# Altium schematic sheet RECEIVER.SchDoc: NOT USED
size A; ApprovedBy: NOT USED; CheckedBy: NOT USED; Author: NOT USED; CompanyName: NOT USED; DrawnBy: NOT USED; Engineer: NOT USED; Organization: NOT USED; Address1: NOT USED; Address2: NOT USED; Address3: NOT USED; Address4: NOT USED; Revision: NOT USED; SheetNumber: 2; SheetTotal: 2; sch_PageDescription: sch_PageDescription; sch_PageTitle: sch_PageTitle; DocumentFullPathAndName: NOT USED; DocumentName: NOT USED; ImagePath: NOT USED; ProjectName: NOT USED; Application_BuildNumber: NOT USED
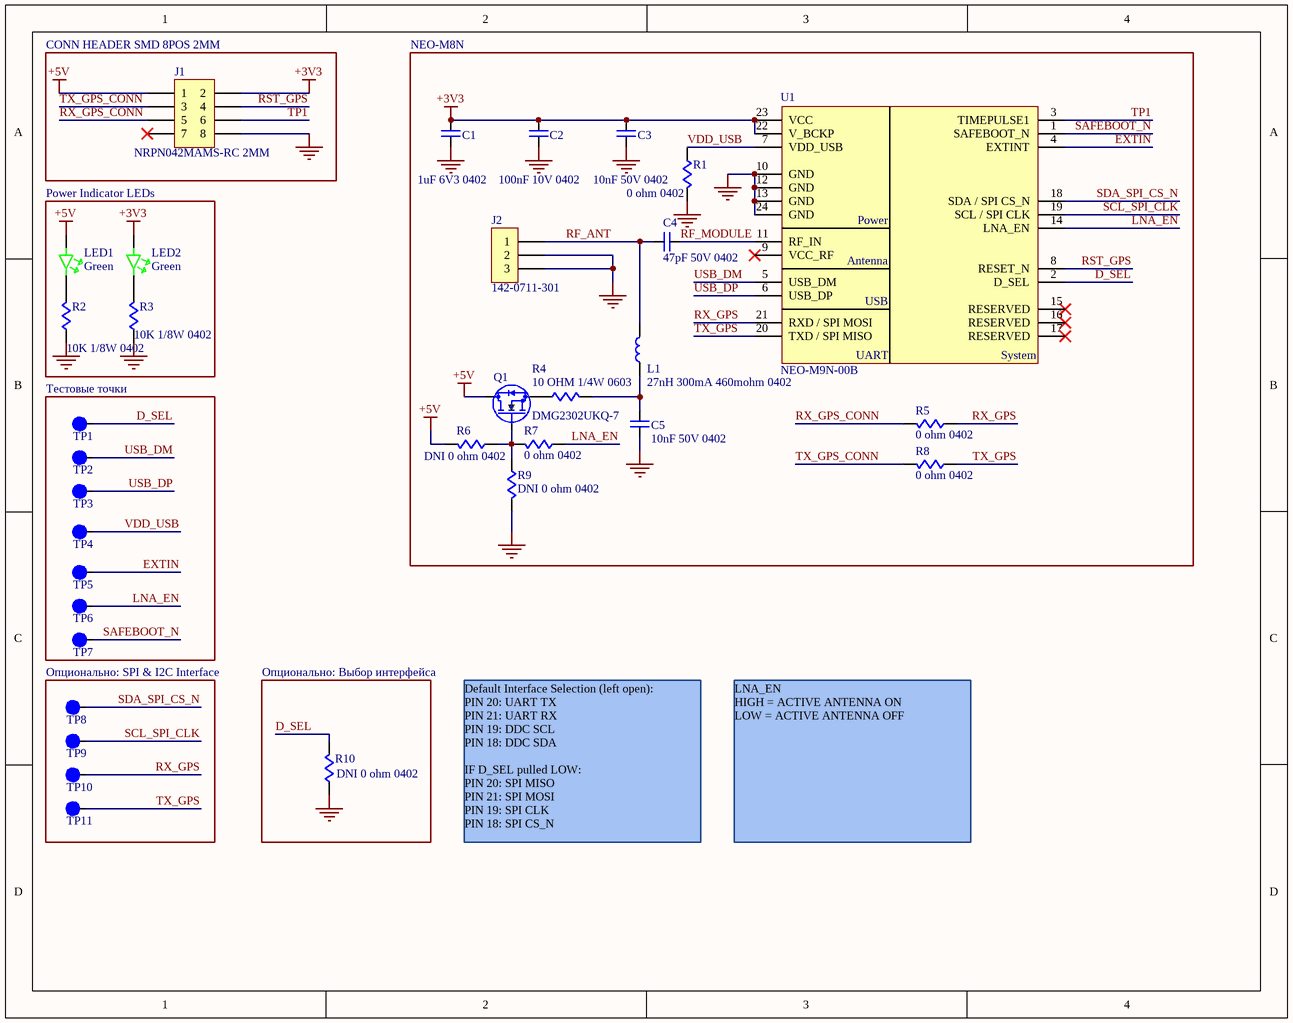
[diagram p0: RECEIVER.SchDoc]

## Parts
C1  1uF 6V3 0402  [c0402]
C2  100nF 10V 0402  [c0402]
C3  10nF 50V 0402  [c0402]
C4  47pF 50V 0402  [c0402]
C5  10nF 50V 0402  [c0402]
J1  NRPN042MAMS-RC 2MM  [CONN_NRPN042MAMS-RC]
J2  142-0711-301  [CONN_131-3711-301]
L1  27nH 300mA 460mohm 0402  [L0402]
LED1  Green  [led0603]
LED2  Green  [led0603]
Q1  DMG2302UKQ-7  [SOT23]
R1  0 ohm 0402  [r0402]
R2  10K 1/8W 0402  [r0402]
R3  10K 1/8W 0402  [r0402]
R4  10 OHM 1/4W 0603  [r0603]
R5  0 ohm 0402  [r0402]
R6  DNI 0 ohm 0402  [r0402]
R7  0 ohm 0402  [r0402]
R8  0 ohm 0402  [r0402]
R9  DNI 0 ohm 0402  [r0402]
R10  DNI 0 ohm 0402  [r0402]
TP1  1MM  [TP1MM]  (value not drawn)  (no BOM)
TP2  1MM  [TP1MM]  (value not drawn)  (no BOM)
TP3  1MM  [TP1MM]  (value not drawn)  (no BOM)
TP4  1MM  [TP1MM]  (value not drawn)  (no BOM)
TP5  1MM  [TP1MM]  (value not drawn)  (no BOM)
TP6  1MM  [TP1MM]  (value not drawn)  (no BOM)
TP7  1MM  [TP1MM]  (value not drawn)  (no BOM)
TP8  1MM  [TP1MM]  (value not drawn)  (no BOM)
TP9  1MM  [TP1MM]  (value not drawn)  (no BOM)
TP10  1MM  [TP1MM]  (value not drawn)  (no BOM)
TP11  1MM  [TP1MM]  (value not drawn)  (no BOM)
U1  NEO-M9N-00B  [IC_NEO-M9N]

## Blocks framed on the sheet
CONN HEADER SMD 8POS 2MM: J1
NEO-M8N: C1-C5 J2 L1 Q1 R1 R4-R9 U1
Power Indicator LEDs: LED1 LED2 R2 R3
Тестовые точки: TP1-TP7
Опционально: SPI & I2C Interface: TP8-TP11
Опционально: Выбор интерфейса: R10

## Nets
+3V3: C1.2 C2.2 C3.2 J1.2 LED2.1 U1.22(V_BCKP) U1.23(VCC)
+5V: J1.1 LED1.1 Q1.2(D) R6.2
GND: C1.1 C2.1 C3.1 C5.1 J1.8 J2.2 J2.3 R1.2 R2.1 R3.1 R9.2 R10.1 U1.10(GND) U1.12(GND) U1.13(GND) U1.24(GND)
D_SEL: R10.2 TP1.1 U1.2(D_SEL)
EXTIN: TP5.1 U1.4(EXTINT)
LNA_EN: R7.1 TP6.1 U1.14(LNA_EN)
RF_ANT: C4.1 J2.1 L1.2
RF_MODULE: C4.2 U1.11(RF_IN)
RST_GPS: J1.4 U1.8(RESET_N)
RX_GPS: R5.1 TP10.1 U1.21(RXD_/_SPI_MOSI)
RX_GPS_CONN: J1.5 R5.2
SAFEBOOT_N: TP7.1 U1.1(SAFEBOOT_N)
SCL_SPI_CLK: TP9.1 U1.19(SCL_/_SPI_CLK)
SDA_SPI_CS_N: TP8.1 U1.18(SDA_/_SPI_CS_N)
TP1: J1.6 U1.3(TIMEPULSE1)
TX_GPS: R8.1 TP11.1 U1.20(TXD_/_SPI_MISO)
TX_GPS_CONN: J1.3 R8.2
USB_DM: TP2.1 U1.5(USB_DM)
USB_DP: TP3.1 U1.6(USB_DP)
VDD_USB: R1.1 TP4.1 U1.7(VDD_USB)
NetC5_2: C5.2 L1.1 R4.2
NetLED1_2: LED1.2 R2.2
NetLED2_2: LED2.2 R3.2
NetQ1_1: Q1.1(G) R6.1 R7.2 R9.1
NetQ1_3: Q1.3(S) R4.1

Not connected (* = marked no-connect by the designer): J1 7*; U1 9(VCC_RF)* 15(RESERVED)* 16(RESERVED)* 17(RESERVED)*

## Notes on the sheet
- Default Interface Selection (left open):
  PIN 20: UART TX
  PIN 21: UART RX
  PIN 19: DDC SCL
  PIN 18: DDC SDA
  IF D_SEL pulled LOW:
  PIN 20: SPI MISO
  PIN 21: SPI MOSI
  PIN 19: SPI CLK
  PIN 18: SPI CS_N
- LNA_EN
  HIGH = ACTIVE ANTENNA ON
  LOW = ACTIVE ANTENNA OFF
- CONFIDENTIALITY NOTICE
- TITLE
- PROJECT
- ENGINEER
- FILENAME
- GENERATED DATE
- DESCRIPTION
- SCHEMATIC NUMBER
- REV
- SHEET
- THIS DOCUMENT IS CONFIDENTIAL AND CONTAINS DESIGNS AND OTHER PROPRIETARY INFORMATION OF META PLATFORMS TECHNOLOGIES, LLC AND ITS AFFILIATES. THIS DOCUMENT AND THE INFORMATION IT CONTAINS MAY NOT BE DUPLICATED, DISCLOSED OR USED, IN WHOLE OR IN PART, FOR ANY PURPOSE (INCLUDING MANUFACTURE OF ANY COMPONENT) WITHOUT THE PRIOR WRITTEN CONSENT OF META PLATFORMS TECHNOLOGIES, LLC.
- (in symbol IC NEO-M9N-00B) Power; Antenna; USB; UART; System

## Library data of the parts
C1 = CAP CER 1UF 6.3V X7R 0402: 0402 1 uF 6.3 V ±10% Tolerance X7R Multilayer Ceramic Capacitor; Manufacturer: Murata; Manufacturer Part Number: GRM155R70J105KA12J; Voltage Rating: 6.3V; Supplier 1: Digi-Key; RoHS: Yes; Category: Ceramic Capacitors; Stock 1: 7275801; Pricing 1: 1=0.10000, 10=0.07300, 50=0.04000, 100=0.03270, 500=0.02334, 1000=0.01833, 2500=0.01666, 5000=0.01533 (USD); Mount: Surface Mount; Case/Package: 0402; Case Code (Metric): 1005; Case Code (Imperial): 0402; Weight: 0.000212oz; Min Operating Temperature: -55°C; Max Operating Temperature: 125°C; Packaging: Tape and Reel; Capacitance: 1uF; Tolerance: 10%; Dielectric: X7R; Termination: SMD/SMT; Voltage Rating (DC): 6.3V; Package Quantity: 50000; Length: 0.039inch; Width: 0.02inch; Thickness: 0.022inch; RoHS Compliant: Yes; ComponentLink1URL: http://www.mouser.com/ds/2/281/c02e-2905.pdf?src-supplier=Mouser; ComponentLink1Description: http://www.mouser.com/ds/2/281/c02e-2905.pdf?src-supplier=Mouser; ComponentLink2URL: http://search.murata.co.jp/Ceramy/image/img/A01X/G101/ENG/GRM155R70J105KA12-01.pdf?src-supplier=Digi-Key; ComponentLink2Description: http://search.murata.co.jp/Ceramy/image/img/A01X/G101/ENG/GRM155R70J105KA12-01.pdf?src-supplier=Digi-Key; Supplier Part Number 1: 490-13339-1-ND
C2 = CAP CER 0.1UF 10V X7R 0402: CL05 Series 0.1 uF 10 V ±10 % Tolerance X7R SMT Multilayer Ceramic Capacitor; Manufacturer: Samsung; Manufacturer Part Number: CL05B104KP5NNNC; Tolerance: 10%; Supplier 1: Digi-Key; RoHS: Yes; Category: Ceramic Capacitors; Stock 1: 36338332; Pricing 1: 1=0.10000, 10=0.02400, 50=0.01300, 100=0.01050, 500=0.00752, 1000=0.00592, 2500=0.00538, 5000=0.00495 (USD); Mount: Surface Mount; Case/Package: 0402; Case Code (Metric): 1005; Case Code (Imperial): 0402; Contact Plating: Tin; Min Operating Temperature: -55°C; Max Operating Temperature: 125°C; Package Quantity: 1; Packaging: Tape and Reel; Capacitance: 100nF; Voltage Rating: 10V; Dielectric: X7R; Series: CL; Construction: Flat; Length: 1mm; Width: 0.02inch; Height: 0.5mm; Thickness: 0.022inch; Depth: 0.5mm; Radiation Hardening: No; RoHS Compliant: Yes; ComponentLink1URL: https://datasheet.ciiva.com/15165/getdatasheetpartid-37100-15165107.pdf?src-supplier=Verical; ComponentLink1Description: https://datasheet.ciiva.com/15165/getdatasheetpartid-37100-15165107.pdf?src-supplier=Verical; ComponentLink2URL: https://datasheet.ciiva.com/16498/cl05b104kq5nnnc-16498491.pdf?src-supplier=Future+Electronics; ComponentLink2Description: https://datasheet.ciiva.com/16498/cl05b104kq5nnnc-16498491.pdf?src-supplier=Future+Electronics; Supplier Part Number 1: 1276-1002-1-ND
C3 C5 = CAP CER 10000PF 50V X7R 0402: Manufacturer: Murata; Manufacturer Part Number: GCM155R71H103KA55D; Tolerance: 10%; Supplier 1: Digi-Key; RoHS: Yes; Category: Ceramic Capacitors; Stock 1: 16109194; Pricing 1: 1=0.10000, 10=0.02700, 50=0.01460, 100=0.01190, 500=0.00848, 1000=0.00667, 2500=0.00606, 5000=0.00558 (USD); Mount: Surface Mount; Case/Package: 0402; Case Code (Imperial): 0402; Case Code (Metric): 1005; Min Operating Temperature: -55°C; Max Operating Temperature: 125°C; Capacitance: 10nF; Voltage Rating: 50V; Packaging: Tape and Reel; Package Quantity: 1; Dielectric: X7R; Termination: SMD/SMT; Voltage: 50V; Voltage Rating (DC): 50V; Series: GCM; Construction: Flat; Length: 1mm; Width: 0.02inch; Height: 0.5mm; Thickness: 0.022inch; Depth: 0.5mm; Ratings: AEC-Q200; Radiation Hardening: No; REACH SVHC: No SVHC; Lead Free: Lead Free; RoHS Compliant: Yes; ComponentLink1URL: https://datasheet.ciiva.com/130/product-130683.pdf?src-supplier=Digi-Key; ComponentLink1Description: https://datasheet.ciiva.com/130/product-130683.pdf?src-supplier=Digi-Key; ComponentLink2URL: https://datasheet.ciiva.com/130/product-130682.pdf?src-supplier=Digi-Key; ComponentLink2Description: https://datasheet.ciiva.com/130/product-130682.pdf?src-supplier=Digi-Key; ComponentLink3URL: https://datasheet.ciiva.com/130/product-130684.pdf?src-supplier=Digi-Key; ComponentLink3Description: https://datasheet.ciiva.com/130/product-130684.pdf?src-supplier=Digi-Key; ComponentLink4URL: https://datasheet.ciiva.com/11787/0900766b80ef92d0-11787082.pdf?src-supplier=RSComponents; ComponentLink4Description: https://datasheet.ciiva.com/11787/0900766b80ef92d0-11787082.pdf?src-supplier=RSComponents; ComponentLink5URL: https://datasheet.ciiva.com/16199/product-16199584.pdf?src-supplier=Future+Electronics; ComponentLink5Description: https://datasheet.ciiva.com/16199/product-16199584.pdf?src-supplier=Future+Electronics; ComponentLink6URL: https://datasheet.ciiva.com/18100/getdatasheetpartid-27433-18100656.pdf?src-supplier=Verical; ComponentLink6Description: https://datasheet.ciiva.com/18100/getdatasheetpartid-27433-18100656.pdf?src-supplier=Verical; ComponentLink7URL: https://datasheet.ciiva.com/2989/product-2989235.pdf?src-supplier=Avnet; ComponentLink7Description: https://datasheet.ciiva.com/2989/product-2989235.pdf?src-supplier=Avnet; Supplier Part Number 1: 490-4762-1-ND
C4 = CAP CER 47PF 50V C0G/NPO 0402: 0402 47 pF 50 V ±5 % Tolerance NP0 SMT Multilayer Ceramic Capacitor; Manufacturer: Yageo; Manufacturer Part Number: CC0402JRNPO9BN470; Tolerance: 5%; Dielectric: C0G; Insulation Resistance: 100GR; Supplier 1: Digi-Key; RoHS: Yes; Category: Ceramic Capacitors; Stock 1: 4278982; Pricing 1: 1=0.10000, 10=0.01800, 50=0.01000, 100=0.00820, 500=0.00584, 1000=0.00458, 2500=0.00417, 5000=0.00383 (USD); Mount: Surface Mount; Case/Package: 0402; Number of Pins: 2; Case Code (Metric): 1005; Case Code (Imperial): 0402; Weight: 2.3E-05oz; Dielectric Material: Ceramic; Min Operating Temperature: -55°C; Max Operating Temperature: 125°C; Capacitance: 47pF; Voltage Rating: 50V; Package Quantity: 1; Packaging: Tape and Reel; Voltage Rating (DC): 50V; Termination: SMD/SMT; Resistor Type: Ceramic; Voltage: 50V; Series: CC; Length: 1mm; Width: 0.02inch; Height: 0.5mm; Thickness: 0.022inch; Depth: 0.5mm; Radiation Hardening: No; REACH SVHC: No SVHC; Lead Free: Lead Free; RoHS Compliant: Yes; ComponentLink1URL: https://datasheet.ciiva.com/28450/1443161-28450267.pdf?src-supplier=Element14; ComponentLink1Description: https://datasheet.ciiva.com/28450/1443161-28450267.pdf?src-supplier=Element14; ComponentLink2URL: https://datasheet.ciiva.com/8033/1443161-8033638.pdf?src-supplier=Element14; ComponentLink2Description: https://datasheet.ciiva.com/8033/1443161-8033638.pdf?src-supplier=Element14; ComponentLink3URL: https://datasheet.ciiva.com/8033/1443161-8033637.pdf?src-supplier=Element14; ComponentLink3Description: https://datasheet.ciiva.com/8033/1443161-8033637.pdf?src-supplier=Element14; ComponentLink4URL: https://datasheet.ciiva.com/161/mlccorderingcode-161493.pdf?src-supplier=Digi-Key; ComponentLink4Description: https://datasheet.ciiva.com/161/mlccorderingcode-161493.pdf?src-supplier=Digi-Key; ComponentLink5URL: https://datasheet.ciiva.com/161/mlccorderingcode-161492.pdf?src-supplier=Digi-Key; ComponentLink5Description: https://datasheet.ciiva.com/161/mlccorderingcode-161492.pdf?src-supplier=Digi-Key; ComponentLink6URL: https://datasheet.ciiva.com/161/mlccorderingcode-161494.pdf?src-supplier=Digi-Key; ComponentLink6Description: https://datasheet.ciiva.com/161/mlccorderingcode-161494.pdf?src-supplier=Digi-Key; Supplier Part Number 1: 311-1021-1-ND
J1 = CONN_NRPN042MAMS-RC: Dual Row 8 Position 2 mm Pitch Surface Mount Header; Manufacturer: Sullins; Number of Positions: 8; Connector Type: Male Pin; Pitch: 0.079inch; Supplier 1: Digi-Key; Manufacturer Part Number: NRPN042MAMS-RC; RoHS: Yes; Category: Connectors; Stock 1: 10801; Pricing 1: 1=0.76000, 76=0.60237, 152=0.57618, 456=0.47143, 988=0.41904, 4940=0.37830 (USD); Mount: Surface Mount; Color: Black; Contact Plating: Gold; Contact Material: Brass; Housing Material: Nylon; Package Quantity: 1000; Number of Rows: 2; Packaging: Bulk; Termination: Solder; Contact Type: Male Pin; Length: 8mm; Width: 4mm; Height: 1.5mm; Row Spacing: 0.079inch; Contact Mating Length: 0.141inch; Lead Free: Lead Free; RoHS Compliant: Yes; ComponentLink1URL: https://datasheet.ciiva.com/711/nrpnxx2mamx-rc-10495-d-711179.pdf?src-supplier=Digi-Key; ComponentLink1Description: https://datasheet.ciiva.com/711/nrpnxx2mamx-rc-10495-d-711179.pdf?src-supplier=Digi-Key; Supplier Part Number 1: S6009-04-ND
J2 = CONN_131-3711-301: Rf Coaxial Board Mount Connector; Manufacturer: Bel Cinch; Body Material: Brass; Plating: Nickel; Body Plating: Gold; Dielectric Material: PTFE; Impedance: 50R; Voltage Rating: 335V; Gender: Female; Frequency: 4Hz; Connector Type: SMB,Male Pin; Max Frequency: 4GHz; Polarity: Reverse; Operating Frequency: 0 to 4 Hz to GHz; Supplier 1: Digi-Key; Manufacturer Part Number: 131-3711-301; RoHS: Yes; Category: RF / Coaxial Connectors; Stock 1: 475; Pricing 1: 1=7.75000, 10=7.00900, 25=6.62160, 50=6.46000, 100=6.13700, 250=5.49100, 500=5.16800, 1000=4.52200 (USD); Mount: Surface Mount; Case/Package: SMA; Contact Material: Brass; Contact Plating: Gold,Nickel; Housing Color: Gold; Shell Plating: Nickel; Center Contact Plating: Gold; Min Operating Temperature: -65°C; Max Operating Temperature: 165°C; Package Quantity: 25; Packaging: Bulk; Fastening Type: SNAP-ON; Termination: Solder; Orientation: Right Angle; ComponentLink1URL: http://www.mouser.com/Search/include/RoHSCompliant.aspx?qs=sxnx5FoGSWlI%252bs7K%252boh9Yg%3d%3d&src-supplier=Mouser; ComponentLink1Description: http://www.mouser.com/Search/include/RoHSCompliant.aspx?qs=sxnx5FoGSWlI%252bs7K%252boh9Yg%3d%3d&src-supplier=Mouser; ComponentLink2URL: http://www.mouser.com/Search/include/RoHSCompliant.aspx?qs=BzWiDxlKIe%2fRhe5ZDRBb2Q%3d%3d&src-supplier=Mouser; ComponentLink2Description: http://www.mouser.com/Search/include/RoHSCompliant.aspx?qs=BzWiDxlKIe%2fRhe5ZDRBb2Q%3d%3d&src-supplier=Mouser; ComponentLink3URL: http://www.onlinecomponents.com/datasheet/1313711301.aspx?p=11276490&src-supplier=Onlinecomponents.com; ComponentLink3Description: http://www.onlinecomponents.com/datasheet/1313711301.aspx?p=11276490&src-supplier=Onlinecomponents.com; ComponentLink4URL: http://www.mouser.com/Search/include/RoHSCompliant.aspx?qs=sxnx5FoGSWlgU0HI%252bkNgTA%3d%3d&src-supplier=Mouser; ComponentLink4Description: http://www.mouser.com/Search/include/RoHSCompliant.aspx?qs=sxnx5FoGSWlgU0HI%252bkNgTA%3d%3d&src-supplier=Mouser; ComponentLink5URL: http://www.mouser.com/Search/include/RoHSCompliant.aspx?qs=p2XSgoD%252b2ikka7OcbAcBow%3d%3d&src-supplier=Mouser; ComponentLink5Description: http://www.mouser.com/Search/include/RoHSCompliant.aspx?qs=p2XSgoD%252b2ikka7OcbAcBow%3d%3d&src-supplier=Mouser; ComponentLink6URL: http://www.mouser.com/Search/include/RoHSCompliant.aspx?qs=CoHYZihNMM5AOHZHjTCMkA%3d%3d&src-supplier=Mouser; ComponentLink6Description: http://www.mouser.com/Search/include/RoHSCompliant.aspx?qs=CoHYZihNMM5AOHZHjTCMkA%3d%3d&src-supplier=Mouser; ComponentLink7URL: http://www.mouser.com/Search/include/RoHSCompliant.aspx?qs=hJAXt0VUbWsyDbF0CdNvSg%3d%3d&src-supplier=Mouser; ComponentLink7Description: http://www.mouser.com/Search/include/RoHSCompliant.aspx?qs=hJAXt0VUbWsyDbF0CdNvSg%3d%3d&src-supplier=Mouser; Supplier Part Number 1: J10507-ND
L1 = FIXED IND 27NH 350MA 460MOHM SMD: Inductor RF Chip Multi-Layer 27nH 5% 100MHz 8Q-Factor Air 300mA 460mOhm DCR 0402 Paper T/R; Manufacturer: Murata; Manufacturer Part Number: LQG15HS27NJ02D; Shielding: Unshielded; Self Resonant Frequency: 1.7GHz; Q Factor: 8; DC Resistance (DCR): 460mR; Supplier 1: Digi-Key; RoHS: Yes; Category: Fixed Inductors; Stock 1: 819111; Pricing 1: 1=0.10000, 10=0.05300, 25=0.04720, 50=0.04020, 100=0.03550, 250=0.03248, 500=0.02954, 1000=0.02482, 2500=0.02127 (USD); Mount: Surface Mount; Case/Package: 0402; Core Material: Air; Case Code (Metric): 1005; Case Code (Imperial): 0402; Min Operating Temperature: -55°C; Max Operating Temperature: 125°C; Package Quantity: 10000; Current Rating: 300mA; Tolerance: 5%; Packaging: Tape and Reel; Inductance Tolerance: 5%; Inductance: 27nH; Test Frequency: 100MHz; Max DC Current: 300mA; Termination: SMD/SMT; DC Current: 300mA; Series: LQG15HS; Rated Current-Max: 300mA; Length: 1mm; Width: 0.02inch; Height: 0.5mm; Height - Seated (Max): 0.022inch; Depth: 0.55mm; REACH SVHC: No SVHC; Military Standard: Not; Lead Free: Lead Free; RoHS Compliant: Yes; ComponentLink1URL: https://datasheet.ciiva.com/11799/0900766b80f10809-11799242.pdf?src-supplier=RSComponents; ComponentLink1Description: https://datasheet.ciiva.com/11799/0900766b80f10809-11799242.pdf?src-supplier=RSComponents; ComponentLink2URL: https://datasheet.ciiva.com/1038/l0075s0083lqg15hs-1038146.pdf?src-supplier=Digi-Key; ComponentLink2Description: https://datasheet.ciiva.com/1038/l0075s0083lqg15hs-1038146.pdf?src-supplier=Digi-Key; ComponentLink3URL: https://datasheet.ciiva.com/1038/l0075s0083lqg15hs-1038145.pdf?src-supplier=Digi-Key; ComponentLink3Description: https://datasheet.ciiva.com/1038/l0075s0083lqg15hs-1038145.pdf?src-supplier=Digi-Key; ComponentLink4URL: https://datasheet.ciiva.com/1038/l0075s0083lqg15hs-1038147.pdf?src-supplier=Digi-Key; ComponentLink4Description: https://datasheet.ciiva.com/1038/l0075s0083lqg15hs-1038147.pdf?src-supplier=Digi-Key; ComponentLink5URL: https://datasheet.ciiva.com/3082/l0075s0083lqg15hs-3082179.pdf?src-supplier=Avnet; ComponentLink5Description: https://datasheet.ciiva.com/3082/l0075s0083lqg15hs-3082179.pdf?src-supplier=Avnet; ComponentLink6URL: https://datasheet.ciiva.com/16360/l0075s0083lqg15hs-16360143.pdf?src-supplier=Future+Electronics; ComponentLink6Description: https://datasheet.ciiva.com/16360/l0075s0083lqg15hs-16360143.pdf?src-supplier=Future+Electronics; Supplier Part Number 1: 490-2628-1-ND
LED1 LED2 = LED GREEN CLEAR CHIP SMD: LED High-Power Uni-Color Green 574nm 2-Pin Chip LED T/R; Manufacturer: Vishay Lite-On; Manufacturer Part Number: LTST-C190KGKT; Lens Color: Colorless; Lens Style: Diffused,Colorless,Rectangular,Clear; Forward Voltage: 2V; Forward Current: 30mA; Luminous Intensity: 35mcd; Viewing Angle: 130°; Power Rating: 75mW; Dominant Wavelength: 571nm; Test Current: 20mA; Lens Transparency: Clear; Number of Elements: 1; Reverse Voltage: 5V; Supplier 1: Digi-Key; RoHS: Yes; Category: LEDs; Stock 1: 1803324; Pricing 1: 1=0.24000, 10=0.13200, 100=0.06110, 500=0.05640, 1000=0.04418, 2000=0.04324 (USD); Mount: Surface Mount; Case/Package: 0603; Number of Pins: 2; Color: Green; Case Code (Metric): 1608; Case Code (Imperial): 0603; Min Operating Temperature: -55°C; Max Operating Temperature: 85°C; Package Quantity: 1; Packaging: Tape and Reel; Illumination Color: Green; Power Dissipation: 75mW; Wavelength: 574nm; Number of LEDs: 1; Length: 1.6mm; Width: 0.8mm; Height: 0.8mm; Depth: 0.8mm; Radiation Hardening: No; Lead Free: Lead Free; RoHS Compliant: Yes; ComponentLink1URL: https://datasheet.ciiva.com/11774/0900766b80dc02a8-11774060.pdf?src-supplier=RSComponents; ComponentLink1Description: https://datasheet.ciiva.com/11774/0900766b80dc02a8-11774060.pdf?src-supplier=RSComponents; ComponentLink2URL: https://datasheet.ciiva.com/12403/100-ltst-c190kgkt-63268-12403899.pdf?src-supplier=Mouser; ComponentLink2Description: https://datasheet.ciiva.com/12403/100-ltst-c190kgkt-63268-12403899.pdf?src-supplier=Mouser; ComponentLink3URL: https://datasheet.ciiva.com/15117/getdatasheetpartid-141494-15117731.pdf?src-supplier=Verical; ComponentLink3Description: https://datasheet.ciiva.com/15117/getdatasheetpartid-141494-15117731.pdf?src-supplier=Verical; ComponentLink4URL: https://datasheet.ciiva.com/2109/s-110-ltst-c190kgkt-2109989.pdf?src-supplier=Digi-Key; ComponentLink4Description: https://datasheet.ciiva.com/2109/s-110-ltst-c190kgkt-2109989.pdf?src-supplier=Digi-Key; ComponentLink5URL: https://datasheet.ciiva.com/2109/s-110-ltst-c190kgkt-2109988.pdf?src-supplier=Digi-Key; ComponentLink5Description: https://datasheet.ciiva.com/2109/s-110-ltst-c190kgkt-2109988.pdf?src-supplier=Digi-Key; ComponentLink6URL: https://datasheet.ciiva.com/2109/s-110-ltst-c190kgkt-2109990.pdf?src-supplier=Digi-Key; ComponentLink6Description: https://datasheet.ciiva.com/2109/s-110-ltst-c190kgkt-2109990.pdf?src-supplier=Digi-Key; Supplier Part Number 1: 160-1435-1-ND
Q1 = DMG2302UKQ-7: N-Channel 20 V 2.8A (Ta) 660mW (Ta) Surface Mount SOT-23-3; Mfr_Name: Diodes Inc; Manufacturer: Diodes; Type: DEV; Drain to Source Voltage (Vdss): 20V; Rds On Max: 90mR; Input Capacitance: 130pF; Copyright: Copyright (C) 2022 Ultra Librarian. All rights reserved.; Manufacturer_Part_Number: DMG2302UKQ-7; Digi-Key_Part_Number_1: 31-DMG2302UKQ-7TR-ND; Digi-Key_Part_Number_2: 31-DMG2302UKQ-7CT-ND; Digi-Key_Part_Number_3: 31-DMG2302UKQ-7DKR-ND; RefDes: RefDes; Supplier 1: Digi-Key; Manufacturer Part Number: DMG2302UKQ-7; RoHS: Yes; Stock 1: 997695; Pricing 1: 1=0.48000, 10=0.36000, 100=0.22400, 500=0.15330, 1000=0.11792 (USD); Mount: Surface Mount; Case/Package: SOT-23; Min Operating Temperature: -55°C; Max Operating Temperature: 150°C; Packaging: Tape and Reel; Continuous Drain Current (ID): 2.8A; Max Power Dissipation: 660mW; Supplier Part Number 1: 31-DMG2302UKQ-7CT-ND
R1 R5-R10 = RES 0 OHM JUMPER 1/16W 0402: RES SMD 0 OHM JUMPER 1/16W 0402; Manufacturer: Yageo; Manufacturer Part Number: RC0402JR-070RL; Resistance: 0mR; Power Rating: 62.5mW; Tolerance: 5%; Voltage Rating: 50V; Max Power Dissipation: 63mW; Temperature Coefficient: 200ppm/°C; Supplier 1: Digi-Key; RoHS: Yes; Category: Chip SMD Resistors; Stock 1: 45165868; Pricing 1: 1=0.10000, 10=0.01200, 25=0.00840, 50=0.00640, 100=0.00480, 250=0.00364, 500=0.00290, 1000=0.00214, 5000=0.00154 (USD); Case/Package: 0402; Case Code (Metric): 1005; Case Code (Imperial): 0402; Contact Plating: Tin,Matte; Size Code: 0402; Min Operating Temperature: -55°C; Max Operating Temperature: 155°C; Package Quantity: 1; Packaging: Tape and Reel; Resistor Type: Thick Film; Number of Terminations: 2; Termination: SMD/SMT; Features: Moisture Resistant; Series: RC; Technology: THICK FILM; Resistance Tolerance: 5%; Construction: Rectangular; Length: 1mm; Width: 0.02inch; Height: 0.016inch; Depth: 0.5mm; Radiation Hardening: No; REACH SVHC: Unknown; Military Standard: Not; Lead Free: Lead Free; RoHS Compliant: Yes; ComponentLink1URL: https://datasheet.ciiva.com/2452/pyu-rc0402-51-rohs-l-6-2452608.pdf?src-supplier=Digi-Key; ComponentLink1Description: https://datasheet.ciiva.com/2452/pyu-rc0402-51-rohs-l-6-2452608.pdf?src-supplier=Digi-Key; ComponentLink2URL: https://datasheet.ciiva.com/11808/0900766b80c66297-11808195.pdf?src-supplier=RSComponents; ComponentLink2Description: https://datasheet.ciiva.com/11808/0900766b80c66297-11808195.pdf?src-supplier=RSComponents; ComponentLink3URL: https://datasheet.ciiva.com/7983/1018594-7983535.pdf?src-supplier=Element14; ComponentLink3Description: https://datasheet.ciiva.com/7983/1018594-7983535.pdf?src-supplier=Element14; ComponentLink4URL: https://datasheet.ciiva.com/22747/1018594-22747515.pdf?src-supplier=Element14; ComponentLink4Description: https://datasheet.ciiva.com/22747/1018594-22747515.pdf?src-supplier=Element14; ComponentLink5URL: https://datasheet.ciiva.com/2452/pyu-r-int-thick-7-2452609.pdf?src-supplier=Digi-Key; ComponentLink5Description: https://datasheet.ciiva.com/2452/pyu-r-int-thick-7-2452609.pdf?src-supplier=Digi-Key; ComponentLink6URL: https://datasheet.ciiva.com/2452/pyu-r-int-thick-7-2452610.pdf?src-supplier=Digi-Key; ComponentLink6Description: https://datasheet.ciiva.com/2452/pyu-r-int-thick-7-2452610.pdf?src-supplier=Digi-Key; ComponentLink7URL: https://datasheet.ciiva.com/8896/pyu-rc0402-51-rohs-l-6-8896201.pdf?src-supplier=Avnet; ComponentLink7Description: https://datasheet.ciiva.com/8896/pyu-rc0402-51-rohs-l-6-8896201.pdf?src-supplier=Avnet; ComponentLink8URL: https://datasheet.ciiva.com/15189/getdatasheetpartid-326379-15189533.pdf?src-supplier=Verical; ComponentLink8Description: https://datasheet.ciiva.com/15189/getdatasheetpartid-326379-15189533.pdf?src-supplier=Verical; Supplier Part Number 1: 311-0.0JRCT-ND
R2 R3 = RES 10K OHM 1% 1/8W 0402: Res Thick Film 0402 10K Ohm 1% 0.125W(1/8W) ±100ppm/°C Pad SMD T/R; Manufacturer: TE Connectivity; Manufacturer Part Number: CRGP0402F10K; Resistance: 10kR; Max Power Dissipation: 125mW; Supplier 1: Digi-Key; RoHS: Yes; Category: Chip SMD Resistors; Stock 1: 486326; Pricing 1: 1=0.11000, 10=0.09700, 100=0.03730, 1000=0.01639, 2500=0.01416, 5000=0.01267 (USD); Case/Package: 0402; Case Code (Imperial): 0402; Case Code (Metric): 1005; Min Operating Temperature: -55°C; Max Operating Temperature: 155°C; Resistor Type: Thick Film; Packaging: Tape and Reel; Tolerance: 1%; Temperature Coefficient: 100ppm/°C; Number of Terminations: 2; RoHS Compliant: Yes; ComponentLink1URL: https://4donline.ihs.com/images/VipMasterIC/IC/TYEL/TYEL-S-A0005460475/TYEL-S-A0005460475-1.pdf?hkey=52A5661711E402568146F3353EA87419&src-supplier=Farnell; ComponentLink1Description: https://4donline.ihs.com/images/VipMasterIC/IC/TYEL/TYEL-S-A0005460475/TYEL-S-A0005460475-1.pdf?hkey=52A5661711E402568146F3353EA87419&src-supplier=Farnell; ComponentLink2URL: https://www.te.com/commerce/DocumentDelivery/DDEController?Action=srchrtrv&amp;DocNm=9-1773463-9&amp;DocType=DS&amp;DocLang=English&src-supplier=Digi-Key; ComponentLink2Description: https://www.te.com/commerce/DocumentDelivery/DDEController?Action=srchrtrv&amp;DocNm=9-1773463-9&amp;DocType=DS&amp;DocLang=English&src-supplier=Digi-Key; ComponentLink3URL: https://4donline.ihs.com/images/VipMasterIC/IC/TYEL/TYEL-S-A0005460475/TYEL-S-A0005460475-1.pdf?hkey=52A5661711E402568146F3353EA87419&src-supplier=Element14; ComponentLink3Description: https://4donline.ihs.com/images/VipMasterIC/IC/TYEL/TYEL-S-A0005460475/TYEL-S-A0005460475-1.pdf?hkey=52A5661711E402568146F3353EA87419&src-supplier=Element14; Supplier Part Number 1: A130367CT-ND
R4 = RES SMD 10 OHM 1% 1/4W 0603: Res Surge Chip Thick Film 0603 10 Ohm 1% 1/4W ±200ppm/°C Molded Paper T/R; Manufacturer: Yageo; Manufacturer Part Number: SR0603FR-7T10RL; Supplier 1: Digi-Key; RoHS: Yes; Category: Chip SMD Resistors; Stock 1: 13323; Pricing 1: 1=0.75000, 10=0.55100, 100=0.32080, 1000=0.17992, 2500=0.17370 (USD); RoHS Compliant: Yes; ComponentLink1URL: http://www.yageo.com/documents/recent/PYu-SR_D_F%20tol_RoHS_L_3.pdf?src-supplier=Digi-Key; ComponentLink1Description: http://www.yageo.com/documents/recent/PYu-SR_D_F%20tol_RoHS_L_3.pdf?src-supplier=Digi-Key; Supplier Part Number 1: YAG5824CT-ND
TP1-TP11 = TP_1MM: Test Point 1MM diameter
U1 = IC NEO-M9N-00B: GNSS module, Flash, TCXO, SAW, LNA, LCC, 12x16 mm Professional Grade; Manufacturer: u-blox; Supplier 1: Digi-Key; Manufacturer Part Number: NEO-M9N-00B; RoHS: Yes; Category: RF Receivers, Transceivers; Stock 1: 250; Pricing 1: 1=27.00000, 10=23.92000, 50=19.61000, 100=15.68010 (USD); RoHS Compliant: Yes; Supplier Part Number 1: 672-NEO-M9N-00BCT-ND